# Altium schematic sheet LED.SchDoc: LED Cube 8x8x8 - LED
size A4; Author: Luka Penger; CompanyName: L. Penger; DrawnBy: Luka Penger; Organization: L. Penger; Address1: Luka Penger; Address2: http://lukapenger.eu; Address3: Software & Hardware; Address4: Development; DocumentNumber: 3; Revision: 4.1.0; SheetNumber: 3; SheetTotal: 4; DocumentName: LED; ProjectName: LED Cube 8x8x8
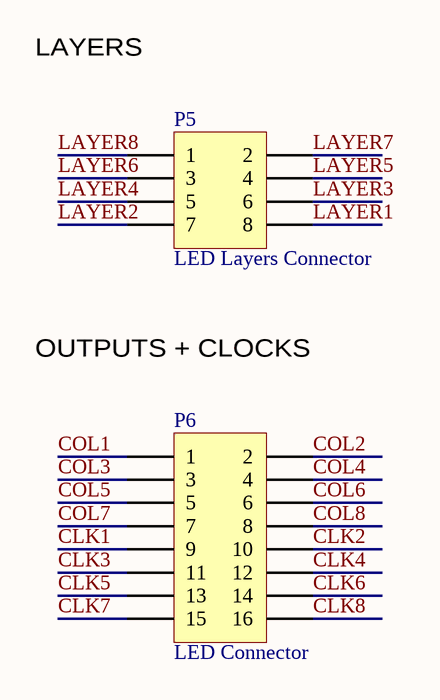
[diagram p0: LED.SchDoc]

## Parts
P5  LED Layers Connector  [IDC-2x4]
P6  LED Connector  [IDC-2x8]

## Nets
CLK1: P6.9
CLK2: P6.10
CLK3: P6.11
CLK4: P6.12
CLK5: P6.13
CLK6: P6.14
CLK7: P6.15
CLK8: P6.16
COL1: P6.1
COL2: P6.2
COL3: P6.3
COL4: P6.4
COL5: P6.5
COL6: P6.6
COL7: P6.7
COL8: P6.8
LAYER1: P5.8
LAYER2: P5.7
LAYER3: P5.6
LAYER4: P5.5
LAYER5: P5.4
LAYER6: P5.3
LAYER7: P5.2
LAYER8: P5.1

## Notes on the sheet
- LAYERS
- OUTPUTS + CLOCKS
- Title
- Size:
- Date:
- A4
- Number:
- Time:
- Revision:
- Sheet
- of
- File:

## Library data of the parts
P5 = Header 4X2: Header, 4-Pin, Dual row; LatestRevisionDate: 17-Jul-2002; LatestRevisionNote: Re-released for DXP Platform.; Publisher: Altium Limited
P6 = Header 8X2: Header, 8-Pin, Dual row; LatestRevisionDate: 17-Jul-2002; LatestRevisionNote: Re-released for DXP Platform.; Publisher: Altium Limited